# EAGLE design OpenTx-SPort-Bridge_v040 (EAGLE 7.5.0)
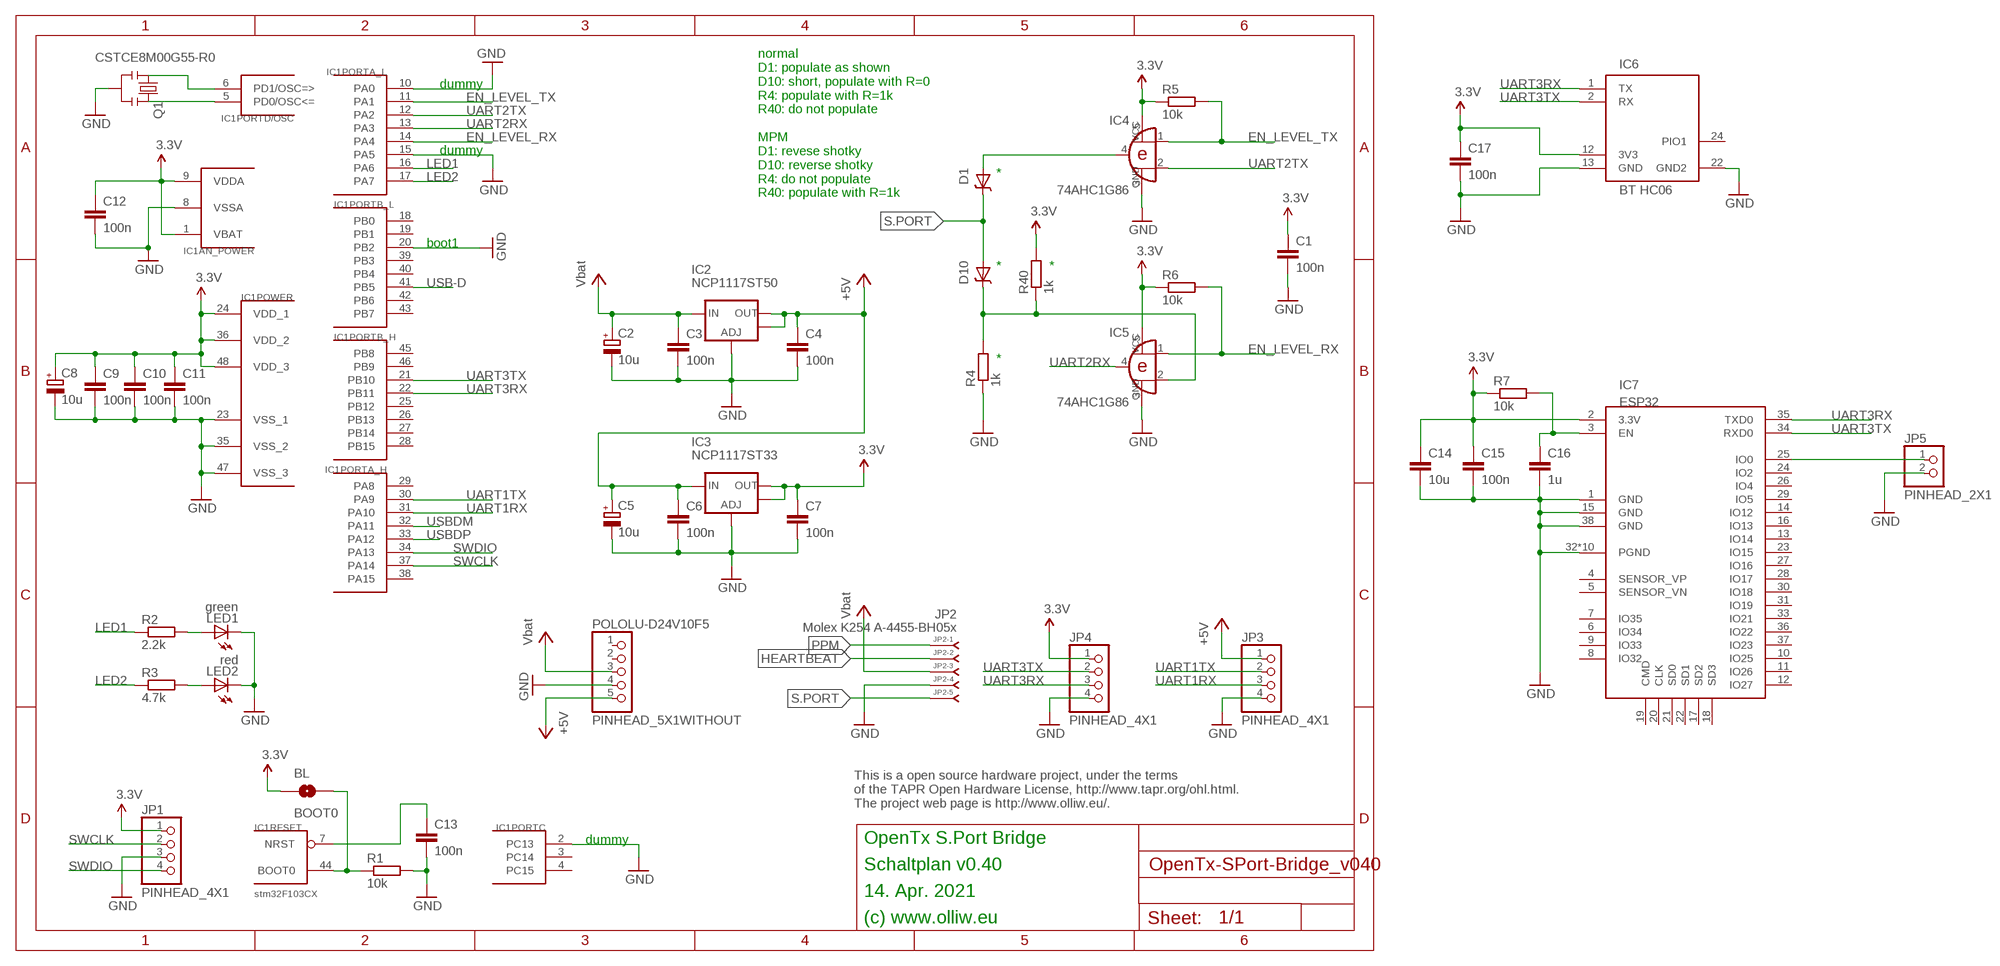
[diagram p0: schematic, sheet 1]

## Parts
BL  BOOT0  SOLDERJUMPERNO  [SJ_2S-NO]
C1  100n  C-EUC0603  [C0603]
C2  10u  CPOL-EUSMCA  [SMC_A]
C3  100n  C-EUC0603  [C0603]
C4  100n  C-EUC0603  [C0603]
C5  10u  CPOL-EUSMCA  [SMC_A]
C6  100n  C-EUC0603  [C0603]
C7  100n  C-EUC0603  [C0603]
C8  10u  CPOL-EUSMCA  [SMC_A]
C9  100n  C-EUC0603  [C0603]
C10  100n  C-EUC0603  [C0603]
C11  100n  C-EUC0603  [C0603]
C12  100n  C-EUC0603  [C0603]
C13  100n  C-EUC0603  [C0603]
C14  10u  C-EUC0805  [C0805]
C15  100n  C-EUC0603  [C0603]
C16  1u  C-EUC0603  [C0603]
C17  100n  C-EUC0603  [C0603]
D1  PMEG3010ER  DIODE-SCHOTTKYSOD123-W  [SOD123W-DIODE]
D10  PMEG3010ER  DIODE-SCHOTTKYSOD123-W  [SOD123W-DIODE]
IC1  stm32F103CX  STM32F10XCXT6  [TQFP48]
IC2  NCP1117ST50  V_REG_LM1117SOT223  [SOT223]
IC3  NCP1117ST33  V_REG_LM1117SOT223  [SOT223]
IC4  74AHC1G86  [SOT23-5-VER1]
IC5  74AHC1G86  [SOT23-5-VER1]
IC6  BT HC06  HC06-BASIC  [BT_HC05_BASIC]
IC7  ESP32  [ESP-WROOM-32D]
JP1  PINHEAD_4X1  [PINHEAD_4X1]
JP2  Molex K254 A-4455-BH05x  4455-B05_S  [4455-B05]
JP3  PINHEAD_4X1  [PINHEAD_4X1]
JP4  PINHEAD_4X1  [PINHEAD_4X1]
JP5  PINHEAD_2X1  [PINHEAD_2X1]
LED1  green  LED3MM  [LED3MM]
LED2  red  LED3MM  [LED3MM]
POLOLU-D24V10F5  PINHEAD_5X1WITHOUT  [PINHEAD_5X1_WO]
Q1  CSTCE8M00G55-R0  RESONATORSMD  [RESONATOR-SMD]
R1  10k  R-EU_R0603  [R0603]
R2  2.2k  R-EU_R0603  [R0603]
R3  4.7k  R-EU_R0603  [R0603]
R4  1k  R-EU_R0603  [R0603]
R5  10k  R-EU_R0603  [R0603]
R6  10k  R-EU_R0603  [R0603]
R7  10k  R-EU_R0603  [R0603]
R40  1k  R-EU_R0603  [R0603]

## Nets
3.3V: BL.1 C1.1 C7.1 C8.+ C9.1 C10.1 C11.1 C12.1 C14.1 C15.1 C17.1 IC1.1(AN_POWER:VBAT) IC1.9(AN_POWER:VDDA) IC1.24(POWER:VDD_1) IC1.36(POWER:VDD_2) IC1.48(POWER:VDD_3) IC3.2(OUT) IC3.4(OUT) IC4.5(VCC) IC5.5(VCC) IC6.12(3V3) IC7.2(3.3V) JP1.1 JP4.1 R5.1 R6.1 R7.1 R40.2
+5V: C4.1 C5.+ C6.1 IC2.2(OUT) IC2.4(OUT) IC3.3(IN) JP3.1 POLOLU-D24V10F5.5
BOOT0: BL.2 IC1.44(RESET:BOOT0) R1.1
EN_LEVEL_RX: IC1.14(PORTA_L:PA4) IC5.1(I0) R6.2
EN_LEVEL_TX: IC1.11(PORTA_L:PA1) IC4.1(I0) R5.2
GND: C1.2 C2.- C3.2 C4.2 C5.- C6.2 C7.2 C8.- C9.2 C10.2 C11.2 C12.2 C13.2 C14.2 C15.2 C16.2 C17.2 IC1.2(PORTC:PC13) IC1.8(AN_POWER:VSSA) IC1.10(PORTA_L:PA0) IC1.15(PORTA_L:PA5) IC1.20(PORTB_L:PB2) IC1.23(POWER:VSS_1) IC1.35(POWER:VSS_2) IC1.47(POWER:VSS_3) IC2.1(ADJ) IC3.1(ADJ) IC4.3(GND) IC5.3(GND) IC6.13(GND) IC6.22(GND2) IC7.1(GND) IC7.15(GND) IC7.32(PGND) IC7.38(GND) IC7.39(PGND) IC7.40(PGND) IC7.41(PGND) IC7.42(PGND) IC7.43(PGND) IC7.44(PGND) IC7.45(PGND) IC7.46(PGND) IC7.47(PGND) JP1.3 JP2.4 JP3.4 JP4.4 JP5.2 LED1.K(C) LED2.K(C) POLOLU-D24V10F5.4 Q1.2 R1.2 R4.1
HEARTBEAT: JP2.2
LED1: IC1.16(PORTA_L:PA6) R2.1
LED2: IC1.17(PORTA_L:PA7) R3.1
N$1: IC7.25(IO0) JP5.1
N$2: C16.1 IC7.3(EN) R7.2
N$3: D10.C IC5.2(I1) R4.2 R40.1
N$4: D1.A IC4.4(O)
N$5: C13.1 IC1.7(RESET:NRST)
N$8: LED1.A R2.2
N$9: LED2.A R3.2
N$12: IC1.5(PORTD/OSC:PD0/OSC<=) Q1.3
N$14: IC1.6(PORTD/OSC:PD1/OSC=>) Q1.1
PPM: JP2.1
S.PORT: D1.C D10.A JP2.5
SWCLK: IC1.37(PORTA_H:PA14) JP1.2
SWDIO: IC1.34(PORTA_H:PA13) JP1.4
UART1RX: IC1.31(PORTA_H:PA10) JP3.3
UART1TX: IC1.30(PORTA_H:PA9) JP3.2
UART2RX: IC1.13(PORTA_L:PA3) IC5.4(O)
UART2TX: IC1.12(PORTA_L:PA2) IC4.2(I1)
UART3RX: IC1.22(PORTB_H:PB11) IC6.1(TX) IC7.35(TXD0) JP4.3
UART3TX: IC1.21(PORTB_H:PB10) IC6.2(RX) IC7.34(RXD0) JP4.2
USB-D: IC1.41(PORTB_L:PB5)
USBDM: IC1.32(PORTA_H:PA11)
USBDP: IC1.33(PORTA_H:PA12)
VCC: C2.+ C3.1 IC2.3(IN) JP2.3 POLOLU-D24V10F5.3 ; supply symbol labelled Vbat
Unconnected: IC1.3(PORTC:PC14) IC1.4(PORTC:PC15) IC1.18(PORTB_L:PB0) IC1.19(PORTB_L:PB1) IC1.25(PORTB_H:PB12) IC1.26(PORTB_H:PB13) IC1.27(PORTB_H:PB14) IC1.28(PORTB_H:PB15) IC1.29(PORTA_H:PA8) IC1.38(PORTA_H:PA15) IC1.39(PORTB_L:PB3) IC1.40(PORTB_L:PB4) IC1.42(PORTB_L:PB6) IC1.43(PORTB_L:PB7) IC1.45(PORTB_H:PB8) IC1.46(PORTB_H:PB9) IC6.24(PIO1) IC7.4(SENSOR_VP) IC7.5(SENSOR_VN) IC7.6(IO34) IC7.7(IO35) IC7.8(IO32) IC7.9(IO33) IC7.10(IO25) IC7.11(IO26) IC7.12(IO27) IC7.13(IO14) IC7.14(IO12) IC7.16(IO13) IC7.17(SD2) IC7.18(SD3) IC7.19(CMD) IC7.20(CLK) IC7.21(SD0) IC7.22(SD1) IC7.23(IO15) IC7.24(IO2) IC7.26(IO4) IC7.27(IO16) IC7.28(IO17) IC7.29(IO5) IC7.30(IO18) IC7.31(IO19) IC7.33(IO21) IC7.36(IO22) IC7.37(IO23) POLOLU-D24V10F5.1 POLOLU-D24V10F5.2

## Notes on the sheet
- normal
  D1: populate as shown
  D10: short, populate with R=0
  R4: populate with R=1k
  R40: do not populate
  
  MPM
  D1: revese shotky
  D10: reverse shotky
  R4: do not populate
  R40: populate with R=1k
- dummy
- dummy
- *
- boot1
- * | *
- *
- This is a open source hardware project, under the terms
  of the TAPR Open Hardware License, http://www.tapr.org/ohl.html.
  The project web page is http://www.olliw.eu/.
- dummy | OpenTx S.Port Bridge
- Schaltplan v0.40
- 14. Apr. 2021
- (c) www.olliw.eu

## Library data of the parts
BL = # SparkFun2:SOLDERJUMPER: Solder Jumper Standard SMD solder jumper. Used to automate production. Two varients : Normally Open and Normally Closed are the same, but have different paste layers. NC will have a large amount of paste and should jumper during reflow.
C1 C3 C4 C6 C7 C9-C17 = rcl:C-EU: CAPACITOR, European symbol
C2 C5 C8 = rcl:CPOL-EU: POLARIZED CAPACITOR, European symbol
D1 D10 = # stdlib:DIODE-SCHOTTKY
IC1 = # stm32:STM32F10XCXT6: ST STM32F101/103 48pin LQFP
IC2 IC3 = # SparkFun2:V_REG_LM1117: Voltage Regulator LM1117 Standard adjustable voltage regulator but in SMD form. Spark Fun Electronics SKU : COM-00595
IC4 IC5 = # stdlib:74AHC1G86
IC6 = # SerialPortBluetooth:HC06-BASIC
IC7 = # stdlib:ESP32
JP1 JP3 JP4 = # stdlib:PINHEAD_4X1
JP2 = con-molex-kk:4455-B05_S: RECEPTACAL
JP5 = # stdlib:PINHEAD_2X1
LED1 LED2 = led:LED: LED OSRAM: - CHIPLED LG R971, LG N971, LY N971, LG Q971, LY Q971, LO R971, LY R971 LH N974, LH R974 LS Q976, LO Q976, LY Q976 LO Q996 - Hyper CHIPLED LW Q18S LB Q993, LB Q99A, LB R99A - SideLED LS A670, LO A670, LY A670, LG A670, LP A670 LB A673, LV A673, LT A673, LW A673 LH A674 LY A675 LS A676, LA A676, LO A676, LY A676, LW A676 LS A679, LY A679, LG A679 - Hyper Micro SIDELED® LS Y876, LA Y876, LO Y876, LY Y876 LT Y87S - SmartLED LW L88C, LW L88S LB L89C, LB L89S, LG L890 LS L89K, LO L89K, LY L89K LS L896, LA L896, LO L896, LY L896 - TOPLED LS T670, LO T670, LY T670, LG T670, LP T670 LSG T670, LSP T670, LSY T670, LOP T670, LYG T670 LG T671, LOG T671, LSG T671 LB T673, LV T673, LT T673, LW T673 LH T674 LS T676, LA T676, LO T676, LY T676, LB T676, LH T676, LSB T676, LW T676 LB T67C, LV T67C, LT T67C, LS T67K, LO T67K, LY T67K, LW E67C LS E67B, LA E67B, LO E67B, LY E67B, LB E67C, LV E67C, LT E67C LW T67C LS T679, LY T679, LG T679 LS T770, LO T770, LY T770, LG T770, LP T770 LB T773, LV T773, LT T773, LW T773 LH T774 LS E675, LA E675, LY E675, LS T675 LS T776, LA T776, LO T776, LY T776, LB T776 LHGB T686 LT T68C, LB T68C - Hyper Mini TOPLED® LB M676 - Mini TOPLED Santana® LG M470 LS M47K, LO M47K, LY M47K Source: http://www.osram.convergy.de LUXEON: - LUMILED® LXK2-PW12-R00, LXK2-PW12-S00, LXK2-PW14-U00, LXK2-PW14-V00 LXK2-PM12-R00, LXK2-PM12-S00, LXK2-PM14-U00 LXK2-PE12-Q00, LXK2-PE12-R00, LXK2-PE12-S00, LXK2-PE14-T00, LXK2-PE14-U00 LXK2-PB12-K00, LXK2-PB12-L00, LXK2-PB12-M00, LXK2-PB14-N00, LXK2-PB14-P00, LXK2-PB14-Q00 LXK2-PR12-L00, LXK2-PR12-M00, LXK2-PR14-Q00, LXK2-PR14-R00 LXK2-PD12-Q00, LXK2-PD12-R00, LXK2-PD12-S00 LXK2-PH12-R00, LXK2-PH12-S00 LXK2-PL12-P00, LXK2-PL12-Q00, LXK2-PL12-R00 Source: www.luxeon.com KINGBRIGHT: KA-3528ASYC Source: www.kingbright.com
POLOLU-D24V10F5 = # stdlib:PINHEAD_5X1
Q1 = # SparkFun2:RESONATOR: Resonator Small SMD resonator. This is the itty bitty 10/20MHz resonators with built in caps. CSTCE10M0G55 and CSTCE20M0V53. Footprint has been reviewed closely but hasn't been tested yet.
R1-R7 R40 = rcl:R-EU_: RESISTOR, European symbol

## Board
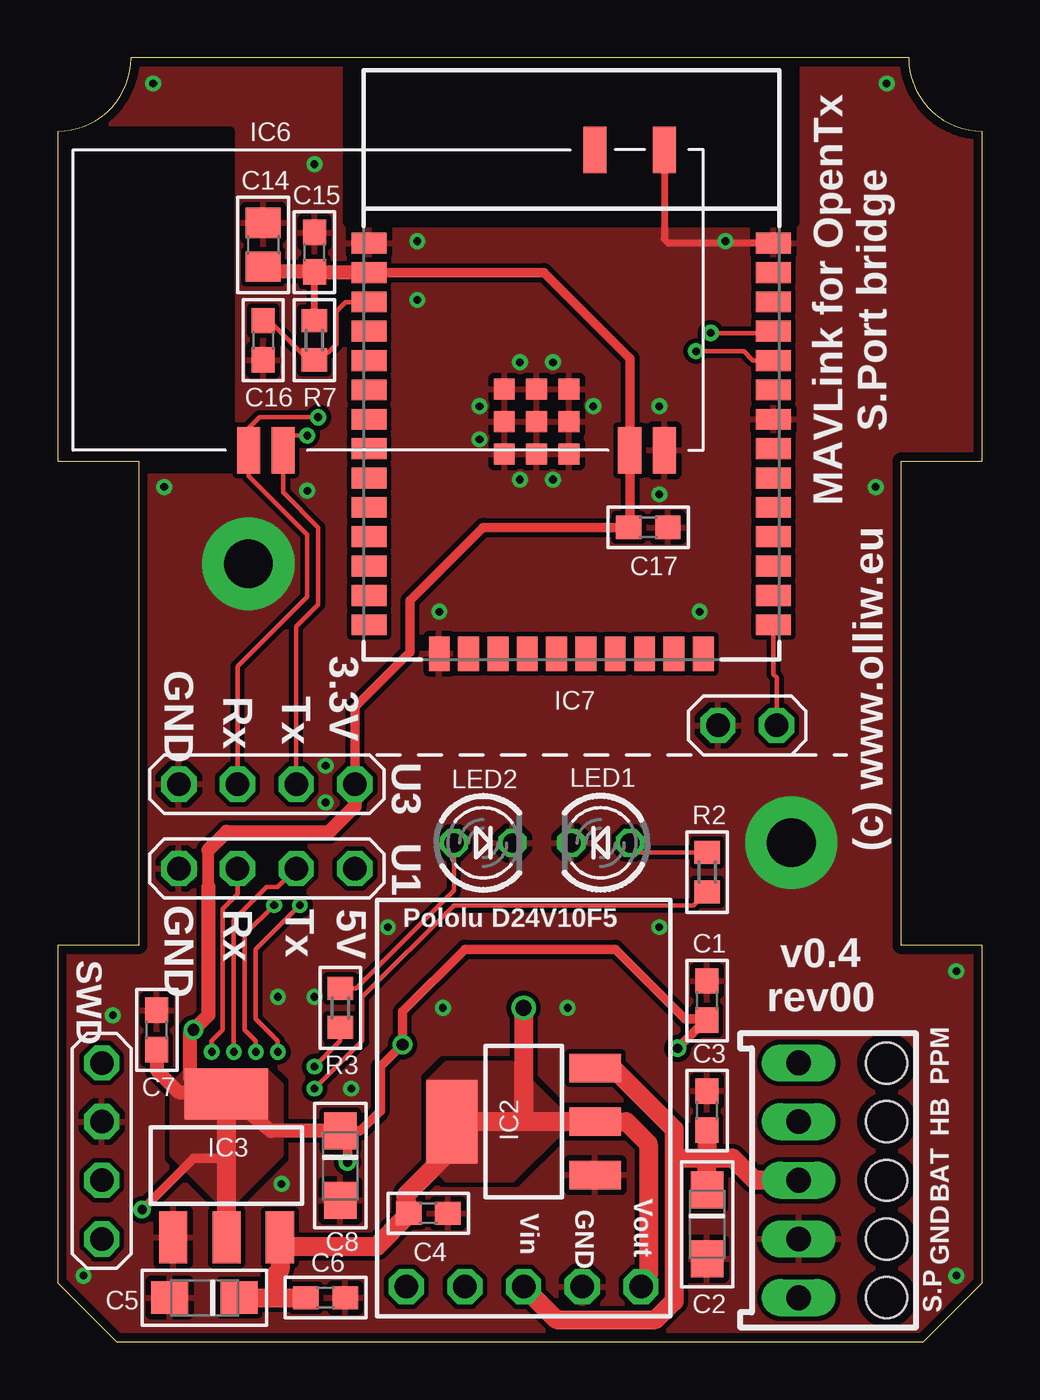
[diagram p1: board, top side]
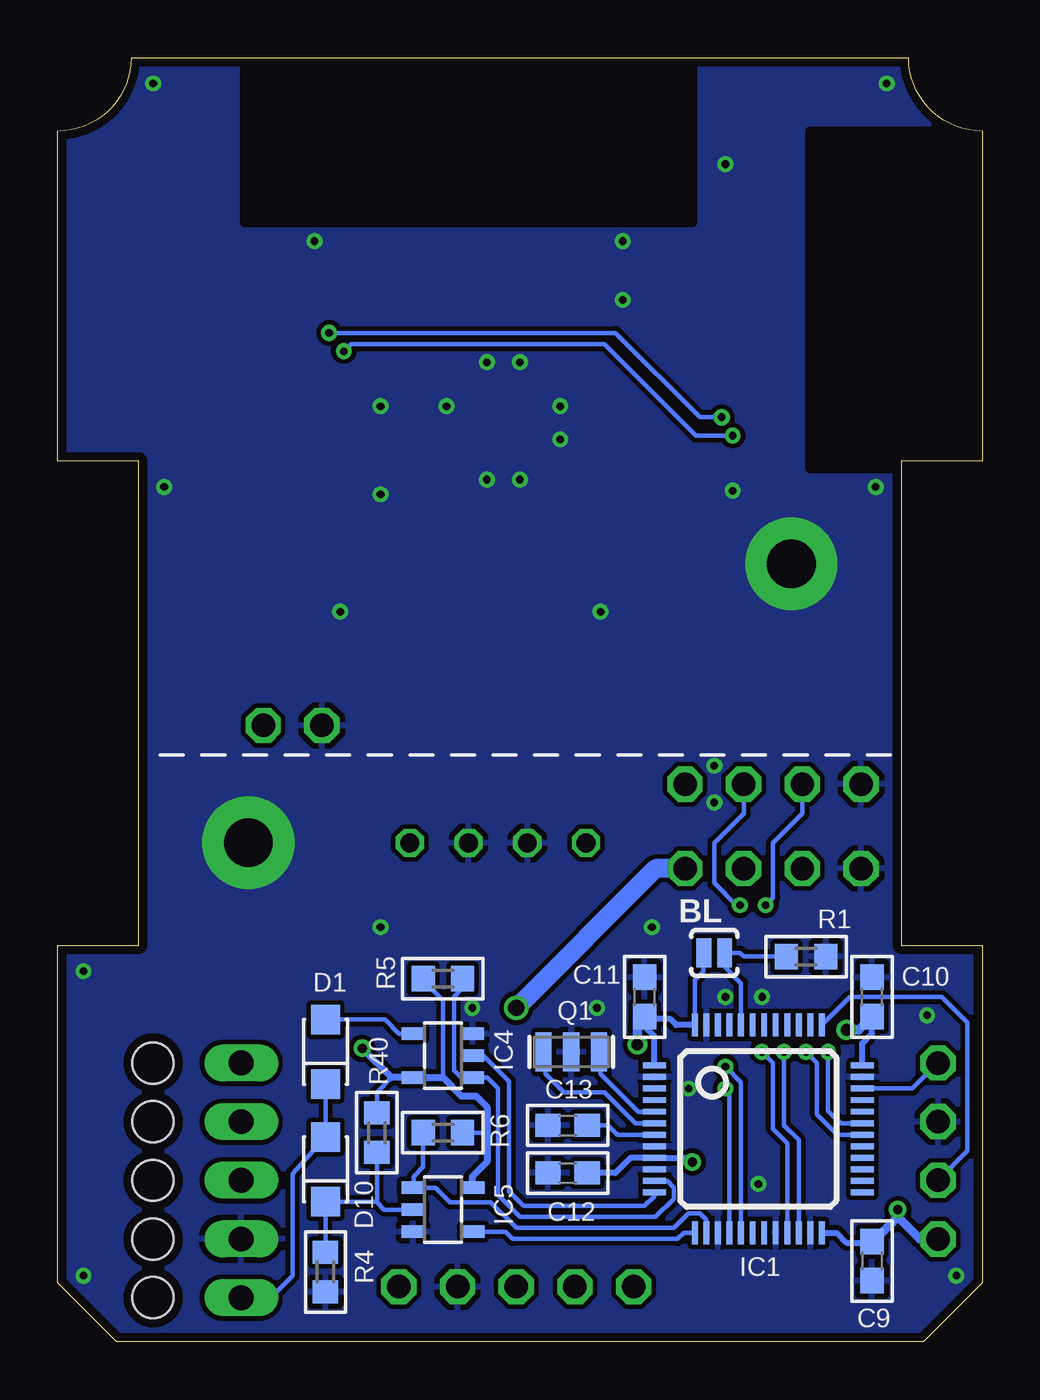
[diagram p2: board, bottom side, seen from below]

Size 40.01 x 55.56 mm. Coordinates in mm from the lower left corner, seen from the top.
Outline: 2.54,0 37.47,0 40.01,2.54 40.01,17.14 36.51,17.14 36.51,38.1 40.01,38.1 40.01,52.39 arc-90 36.83,55.56 3.17,55.56 arc-90 0,52.39 0,38.1 3.49,38.1 3.49,17.14 0,17.14 0,2.54 2.54,0
Copper layers (1*16): Top 0.0356mm / dielectric 1.5011mm / Bottom 0.0356mm
Design rules "ow-oshpark-2layer": minimum track width 6mil, minimum drill 13mil, track to track 6mil, track to pad 6mil, pad to pad 6mil, via to via 6mil, smd to smd 6mil, copper to edge 15mil, drill to drill 6mil, minimum pad ring 7mil, minimum via ring 7mil, stop-mask expansion 2.5mil, vias tented up to drill 26mil, thermal gap 10mil
tRestrict: area 0.2,37.8 to 7.5,52.4; area 12.5,48.4 to 31.9,55.4
bRestrict: area 0.2,37.8 to 7.5,52.4; area 12.5,48.4 to 31.9,55.4

### Footprints (pad centres in the part's own frame; a part is rotated, then mirrored left to right if it is on the bottom)
SJ_2S-NO = smd 0.635 x 1.27: 1 -0.45,0; 2 0.45,0
C0603 = smd 1.1 x 1: 1 -0.85,0; 2 0.85,0
SMC_A = smd 1.6 x 1.4: + -1.5,0; - 1.5,0
C0805 = smd 1.3 x 1.5: 1 -0.95,0; 2 0.95,0
SOD123W-DIODE = smd 1.27 x 1.27: A -1.4,0; C 1.4,0
TQFP48 = smd 0.254 x 1: 1 -2.75,-4.5; 2 -2.25,-4.5; 3 -1.75,-4.5; 4 -1.25,-4.5; 5 -0.75,-4.5; 6 -0.25,-4.5; 7 0.25,-4.5; 8 0.75,-4.5; 9 1.25,-4.5; 10 1.75,-4.5; 11 2.25,-4.5; 12 2.75,-4.5; 25 2.75,4.5; 26 2.25,4.5; 27 1.75,4.5; 28 1.25,4.5; 29 0.75,4.5; 30 0.25,4.5; 31 -0.25,4.5; 32 -0.75,4.5; 33 -1.25,4.5; 34 -1.75,4.5; 35 -2.25,4.5; 36 -2.75,4.5 | smd 1 x 0.254: 13 4.5,-2.75; 14 4.5,-2.25; 15 4.5,-1.75; 16 4.5,-1.25; 17 4.5,-0.75; 18 4.5,-0.25; 19 4.5,0.25; 20 4.5,0.75; 21 4.5,1.25; 22 4.5,1.75; 23 4.5,2.25; 24 4.5,2.75; 37 -4.5,2.75; 38 -4.5,2.25; 39 -4.5,1.75; 40 -4.5,1.25; 41 -4.5,0.75; 42 -4.5,0.25; 43 -4.5,-0.25; 44 -4.5,-0.75; 45 -4.5,-1.25; 46 -4.5,-1.75; 47 -4.5,-2.25; 48 -4.5,-2.75
SOT223 = smd 1.219 x 2.235: 1 -2.311,-3.099; 2 0,-3.099; 3 2.311,-3.099 | smd 3.6 x 2.2: 4 0,3.099
SOT23-5-VER1 = smd 0.55 x 0.99: 1 -0.95,-1.29; 2 0,-1.29; 3 0.95,-1.29; 4 0.95,1.3; 5 -0.95,1.3
BT_HC05_BASIC = smd 2 x 1: 1 0,0; 2 0,-1.5; 12 0,-16.5; 13 0,-18; 22 13,-18; 24 13,-15
ESP-WROOM-32D = smd 1.5 x 0.9: 1 -8.75,18.01; 2 -8.75,16.74; 3 -8.75,15.47; 4 -8.75,14.2; 5 -8.75,12.93; 6 -8.75,11.66; 7 -8.75,10.39; 8 -8.75,9.12; 9 -8.75,7.85; 10 -8.75,6.58; 11 -8.75,5.31; 12 -8.75,4.04; 13 -8.75,2.77; 14 -8.75,1.5; 25 8.75,1.5; 26 8.75,2.77; 27 8.75,4.04; 28 8.75,5.31; 29 8.75,6.58; 30 8.75,7.85; 31 8.75,9.12; 32 8.75,10.39; 33 8.75,11.66; 34 8.75,12.93; 35 8.75,14.2; 36 8.75,15.47; 37 8.75,16.74; 38 8.75,18.01 | smd 0.9 x 1.5: 15 -5.715,0.25; 16 -4.445,0.25; 17 -3.175,0.25; 18 -1.905,0.25; 19 -0.635,0.25; 20 0.635,0.25; 21 1.905,0.25; 22 3.175,0.25; 23 4.445,0.25; 24 5.715,0.25 | smd 0.9 x 0.9: 39 -1.5,10.29; 40 -1.5,11.69; 41 -1.5,8.89; 42 -0.1,11.69; 43 -0.1,10.29; 44 -0.1,8.89; 45 -2.9,11.69; 46 -2.9,10.29; 47 -2.9,8.89
PINHEAD_4X1 = drill 1.016 octagon: 1 0,7.62; 2 0,5.08; 3 0,2.54; 4 0,0
4455-B05 = drill 1.067 long: 1 -5.08,0; 2 -2.54,0; 3 0,0; 4 2.54,0; 5 5.08,0 | hole 1.778: -5.08,3.81; -2.54,3.81; 0,3.81; 2.54,3.81; 5.08,3.81
PINHEAD_2X1 = drill 1.016 octagon: 1 0,0; 2 0,-2.54
LED3MM = drill 0.813 octagon: A -1.27,0; K 1.27,0
PINHEAD_5X1_WO = drill 1.016 octagon: 1 0,0; 2 0,-2.54; 3 0,-5.08; 4 0,-7.62; 5 0,-10.16
RESONATOR-SMD = smd 0.7 x 1.7: 1 -1.2,0; 2 0,0; 3 1.2,0
R0603 = smd 1 x 1.1: 1 -0.85,0; 2 0.85,0

### Placement (x,y rotation side)
BL  11.59,16.83 0 bottom
C1  28.1,14.76 90 top
C2  28.1,5.08 270 top
C3  28.1,10 90 top
C4  16.03,5.56 0 top
C5  6.35,1.91 180 top
C6  11.59,1.91 0 top
C7  4.29,13.49 90 top
C8  12.22,7.62 270 top
C9  4.76,3.49 270 bottom
C10  4.76,14.92 90 bottom
C11  14.61,14.92 90 bottom
C12  17.94,7.3 180 bottom
C13  17.94,9.37 180 bottom
C14  8.89,47.47 90 top
C15  11.11,47.15 90 top
C16  8.89,43.34 270 top
C17  25.56,35.24 0 top
D1  28.42,12.54 270 bottom
D10  28.42,7.46 270 bottom
IC1  9.68,9.21 270 bottom
IC2  20.16,9.53 90 top
IC3  7.3,7.62 0 top
IC4  23.34,12.38 90 bottom
IC5  23.34,5.71 270 bottom
IC6  8.26,38.58 90 top
IC7  22.22,29.53 0 top
JP1  1.91,12.06 180 top
JP2  32.07,6.99 270 top
JP3  5.24,20.48 270 top
JP4  5.24,24.13 270 top
JP5  31.11,26.67 270 top
LED1  23.49,21.59 180 top
LED2  18.41,21.59 0 top
POLOLU-D24V10F5  15.08,2.38 90 top
Q1  17.78,12.54 0 bottom
R1  7.62,16.67 0 bottom
R2  28.1,20.32 90 top
R3  12.22,14.45 90 top
R4  28.42,3.02 90 bottom
R5  23.34,15.72 0 bottom
R6  23.34,9.05 180 bottom
R7  11.11,43.34 270 top
R40  26.19,9.05 90 bottom

### Tracks (layer width: path | path; a pad name or v marks a point on that pad's centre or on a via)
3.3V  (via drill 0.4, 0.5)
  Top 0.305: 24.75,35.29 C17.1 | IC6.12 | 11.3,46.27 C15.1 R7.1 | 7.46,7.94 7.3,7.62
  Top 0.406: JP4.1 12.86,27.46 15.24,29.84 15.24,32.07 18.41,35.24 C17.1 | IC6.12 24.75,35.29 | IC7.2 21.04,46.27 24.76,42.55 IC6.12 | v3.65,5.71 5.87,7.94 7.46,7.94 | v12.54,7.78 12.54,8.96 C8.+ 13.09,9.12 13.97,10 13.97,11.91 v14.92,12.86 14.92,14.29 17.62,16.99 24.13,16.99 27.15,13.97 28.1,13.97 | 28.1,13.97 28.15,13.65 C1.1 28.36,13.97 28.1,13.97 | 28.1,13.97 v26.83,12.7
  Top 0.508: 6.51,21.27 6.51,19.68
  Top 0.61: IC7.2 11.3,46.27 | C8.+ 9.22,9.12 IC3.4 7.7,10.64 8.1,10.64 7.94,10.79 6.83,10.79 | C7.1 4.29,11.75 5.24,10.79 6.83,10.79 | 6.51,19.68 6.51,14.13 v5.87,13.49 5.71,13.34 5.71,11.43 6.83,10.79 | 6.51,21.27 7.3,22.07 11.75,22.07 12.86,23.18 JP4.1 | C15.1 8.89,46.3 C14.1
  Top 0.813: IC3.2 7.3,7.62 IC3.4 6.21,10.72
  Bottom 0.203: IC1.48 12.43,15.66 12.06,16.03 12.06,16.64 BL.1 | R5.1 24.19,15.61 23.34,14.76 23.34,11.44 23.34,11.43 | R6.1 21.43,9.05 | R40.2 26.19,10.8 25.56,11.43
  Bottom 0.254: C12.1 15.88,7.3 15.22,7.96 IC1.9 12.72,7.96 v12.54,7.78 | IC1.36 5.18,12.91 4.76,13.34 C10.1 | IC1.48 13.23,13.71 13.49,13.97 14.5,13.97 C11.1 14.61,13.65 14.18,13.23 IC1.1 | IC1.24 6.29,4.71 5.87,4.29 4.82,4.29 C9.1
  Bottom 0.305: IC5.5 22.07,6.7 22.07,7.14 21.43,7.78 21.43,9.05 21.43,10.16 21.91,10.64 22.54,10.64 23.34,11.43 IC4.5 25.56,11.43 v26.83,12.7 | 4.71,4.34 4.71,4.29 C9.1
  Bottom 0.406: 4.71,4.34 3.65,5.4 | 3.65,5.4 v3.65,5.71 | JP1.1 2.7,4.45 3.65,5.4 | v14.92,12.86 14.92,13.76 C11.1 | C10.1 5.34,13.49 v5.87,13.49
  pour Top (no thermals): 5.56,11.75 9.05,11.75 9.68,11.11 9.68,8.1 7.78,6.19 6.83,6.19 4.92,8.1 4.92,11.11
+5V  (via drill 0.7)
  Top 0.813: 19.68,9.53 IC2.2 24.61,9.53 25.56,8.57 25.56,2.86 POLOLU-D24V10F5.5 | 19.68,9.53 IC2.4 16.99,9.93 16.99,8.26 15.08,6.35 15.08,6.19 C4.1 15.08,6.09 15.08,5.4 13.81,4.13 9.84,4.13 9.93,4.22 IC3.3 9.61,3.1 9.37,2.86 9.37,1.91 | C5.+ 9.37,1.91 | 9.37,1.91 C6.1 | v20.16,14.45 20.16,9.68 19.68,9.53
  Bottom 0.813: JP3.1 14.13,20.48 v20.16,14.45
  pour Top (no thermals): 16.03,11.27 16.03,7.78 16.83,6.99 19.68,6.99 21.75,9.05 21.75,10 19.68,12.06 16.83,12.06
BOOT0
  Bottom 0.203: IC1.44 10.43,15.51 11.11,16.19 11.11,16.64 BL.2 10.48,16.83 10.32,16.67 R1.1
EN_LEVEL_RX
  Bottom 0.203: 24.62,6.83 IC5.1 | IC5.1 23.65,6.67 23.02,6.03 21.27,6.03 20.16,4.92 13.34,4.92 12.7,5.56 12.22,5.56 11.93,5.27 IC1.14 | R6.2 24.19,7.56 24.61,7.14 24.61,6.68 IC5.1
EN_LEVEL_TX
  Bottom 0.203: IC1.11 13.62,6.96 13.34,6.67 13.34,6.19 14.13,5.4 20,5.4 20.95,6.35 20.95,10.95 21.43,11.43 IC4.1 22.54,11.43 22.86,11.75 22.86,14.92 22.54,15.24 22.54,15.66 R5.2
GND  (via drill 0.33, 2.1 pad 4)
  Top 0.305: IC6.22 26.25,47.72 26.44,47.54 IC7.38
  other vias: 38.89,16.03 20,42.39 21.43,42.39 18.26,40.48 18.26,39.05 20,37.31 21.43,37.31 23.18,40.48 11.11,50.96 28.89,47.62 15.56,47.62 16.51,31.59 27.78,31.59 26.04,40.48 26.04,36.67 38.89,2.86 1.11,2.86 4.6,36.99 35.4,36.99 35.88,54.45 4.13,54.45 9.68,6.83 22.07,14.45 16.67,14.45 11.11,14.92 12.7,10.95 14.29,17.94 9.53,14.92 11.59,23.34 11.59,24.92 26.04,17.94 2.38,14.13 31.75,21.59 8.26,33.66 10.79,36.83 15.56,45.09
  pour Bottom (isolate 0.203, rank 6): -0.64,56.2 40.64,56.2 40.64,-0.64 -0.64,-0.64
  pour Top (isolate 0.203, rank 6): -0.64,56.2 40.64,56.2 40.64,-0.64 -0.64,-0.64
LED1  (via drill 0.33)
  Top 0.203: v11.11,10.95 13.18,13.02 13.18,14.92 17.14,18.89 27.52,18.89 R2.1
  Bottom 0.203: IC1.16 10.93,10.78 v11.11,10.95
LED2  (via drill 0.33)
  Top 0.203: R3.1 12.22,13.02 v11.11,11.91
  Bottom 0.203: v11.11,11.91 10.43,11.23 IC1.17
N$1
  Top 0.203: IC7.25 30.97,28.87 31.11,28.73 JP5.1
N$2
  Top 0.203: IC7.3 12.45,45 12.06,44.61 12.06,43.18 11.69,42.81 R7.2 10.85,42.49 9.15,44.19 C16.1
N$3
  Bottom 0.203: R4.2 D10.C 26.22,6.06 26.19,6.03 | IC5.2 25.88,5.71 26.19,6.03 | 26.19,6.03 R40.1
N$4
  Bottom 0.203: IC4.4 25.24,13.33 25.85,13.94 D1.A
N$5
  Bottom 0.203: IC1.7 15.78,8.96 16.19,9.37 C13.1
N$8
  Top 0.203: R2.2 25.18,21.17 LED1.A
N$9
  Top 0.203: LED2.A 17.14,19.53 12.92,15.3 R3.2
N$12
  Bottom 0.203: IC1.5 14.88,9.96 16.51,11.59 16.51,12.47 Q1.3
N$14
  Bottom 0.203: IC1.6 15.01,9.46 16.35,10.79 18.1,10.79 18.89,11.59 18.89,12.45 Q1.1
S.PORT
  Bottom 0.203: JP2.5 30.8,1.91 29.84,2.86 29.84,7.27 D10.A D1.C
SWCLK
  Bottom 0.203: IC1.37 5.71,14.92 1.75,14.92 0.64,13.81 0.64,8.26 JP1.2
SWDIO
  Bottom 0.203: IC1.34 3.01,10.96 JP1.4
UART1RX  (via drill 0.33)
  Top 0.203: v6.67,12.54 6.67,13.02 7.14,13.49 7.14,18.73 7.78,19.37 JP3.3
  Bottom 0.203: IC1.31 6.12,9.46 6.67,10 v6.67,12.54
UART1TX  (via drill 0.33)
  Top 0.203: JP3.2 9.53,19.68 9.05,19.68 7.62,18.26 v7.62,12.54
  Bottom 0.203: IC1.30 6.26,8.96 7.14,9.84 7.14,12.06 v7.62,12.54
UART2RX
  Bottom 0.203: IC1.13 12.91,4.71 13.18,4.45 20.32,4.45 20.64,4.76 21.88,4.76 IC5.4
UART2TX
  Bottom 0.203: IC1.12 14.18,6.29 14.61,5.87 19.84,5.87 20.48,6.51 20.48,11.27 21.59,12.38 IC4.2
UART3RX  (via drill 0.33, 0.34)
  Top 0.203: JP4.3 7.78,29.21 10.79,32.23 10.79,34.92 8.26,37.47 IC6.1 8.26,39.53 8.73,40.01 v11.27,40.01 | v28.26,43.66 30.48,43.66 30.55,43.73 IC7.35 | v8.57,12.54 8.57,13.02 8.1,13.49 8.1,17.62 v9.37,18.89
  Bottom 0.203: v11.27,40.01 12.22,40.01 15.88,43.66 v28.26,43.66 | v9.37,18.89 9.05,19.21 9.05,21.59 7.78,22.86 JP4.3 | v8.57,12.54 8.57,9.37 7.93,8.73 IC1.22
UART3TX  (via drill 0.33)
  Top 0.203: JP4.2 10.32,30.96 11.27,31.91 11.27,35.24 9.76,36.76 IC6.2 9.76,39.12 9.84,39.21 v10.79,39.21 | IC7.34 30.09,42.46 29.69,42.86 v27.62,42.86 | v9.53,12.54 9.53,13.02 8.57,13.97 8.57,16.99 v10.48,18.89
  Bottom 0.203: v27.62,42.86 27.3,43.18 16.35,43.18 12.38,39.21 v10.79,39.21 | v10.48,18.89 10.64,18.89 11.59,19.84 11.59,21.59 10.32,22.86 JP4.2 | v9.53,12.54 9.05,12.06 9.05,9.21 8.43,8.59 IC1.21
VCC
  Top 0.813: JP2.3 30.16,6.99 29.21,7.94 28.1,7.94 | IC2.3 24.04,11.84 26.67,9.21 26.67,7.94 | C3.1 28.1,7.94 | C2.+ 28.1,7.94 | POLOLU-D24V10F5.3 21.59,0.95 25.88,0.95 26.67,1.75 26.67,7.94 | 28.1,7.94 26.67,7.94

### Text on the board
tNames: MAVLink for OpenTx / S.Port bridge | 3.3V | GND | Rx | Tx | (c) www.olliw.eu | U3 | U1 | GND | Rx | Tx | 5V | Pololu D24V10F5 | SWD | v0.4 / rev00 | PPM | HB | Vin | GND | Vout | BAT | GND | S.P